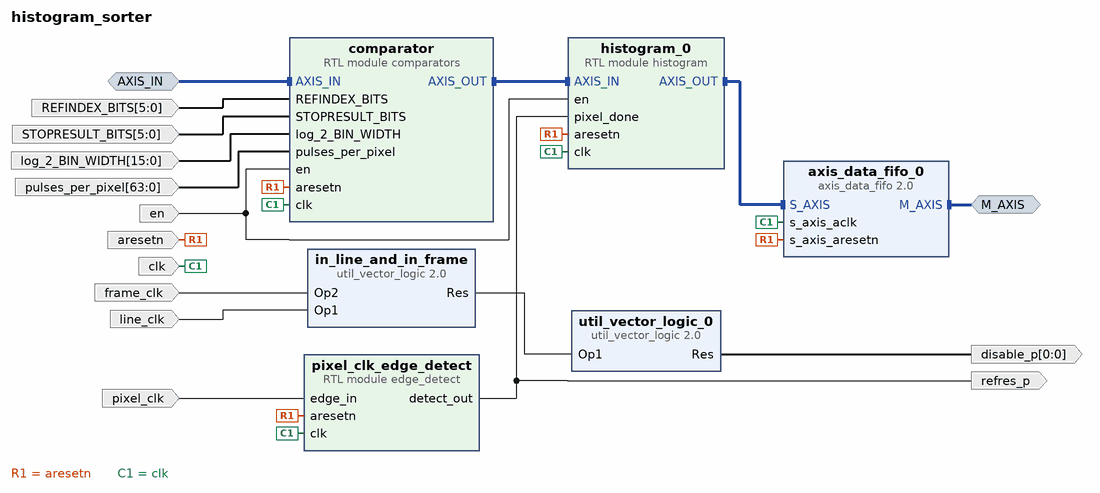
[diagram p0: block diagram of the top level]
# Vivado block design histogram_sorter, xc7z020clg484-1, Vivado 2024.2
create_bd_design histogram_sorter

create_bd_intf_port -mode Slave -vlnv xilinx.com:interface:axis_rtl:1.0 AXIS_IN
set_property -dict [list \
  CONFIG.HAS_TKEEP 0 \
  CONFIG.HAS_TLAST 1 \
  CONFIG.HAS_TREADY 1 \
  CONFIG.HAS_TSTRB 0 \
  CONFIG.LAYERED_METADATA undef \
  CONFIG.TDATA_NUM_BYTES 8 \
  CONFIG.TDEST_WIDTH 0 \
  CONFIG.TID_WIDTH 0 \
  CONFIG.TUSER_WIDTH 0 \
] [get_bd_intf_ports AXIS_IN]
create_bd_intf_port -mode Master -vlnv xilinx.com:interface:axis_rtl:1.0 M_AXIS
create_bd_port -dir I -from 5 -to 0 REFINDEX_BITS
create_bd_port -dir I -from 5 -to 0 STOPRESULT_BITS
create_bd_port -dir I -type rst aresetn
create_bd_port -dir I -type clk clk
set_property -dict {CONFIG.ASSOCIATED_BUSIF AXIS_IN:M_AXIS CONFIG.ASSOCIATED_RESET aresetn} [get_bd_ports clk]
create_bd_port -dir O -from 0 -to 0 disable_p
create_bd_port -dir I en
create_bd_port -dir I frame_clk
create_bd_port -dir I line_clk
create_bd_port -dir I -from 15 -to 0 log_2_BIN_WIDTH
create_bd_port -dir I pixel_clk
create_bd_port -dir I -from 63 -to 0 pulses_per_pixel
create_bd_port -dir O refres_p

create_bd_cell -type ip -vlnv xilinx.com:ip:axis_data_fifo:2.0 axis_data_fifo_0
set_property -dict {CONFIG.FIFO_MEMORY_TYPE auto} [get_bd_cells axis_data_fifo_0]
create_bd_cell -type module -reference comparators comparator
create_bd_cell -type module -reference histogram histogram_0
set_property -dict {CONFIG.NUM_BINS 512} [get_bd_cells histogram_0]
create_bd_cell -type ip -vlnv xilinx.com:ip:util_vector_logic:2.0 in_line_and_in_frame
set_property -dict {CONFIG.C_SIZE 1} [get_bd_cells in_line_and_in_frame]
create_bd_cell -type module -reference edge_detect pixel_clk_edge_detect
create_bd_cell -type ip -vlnv xilinx.com:ip:util_vector_logic:2.0 util_vector_logic_0
set_property -dict {CONFIG.C_OPERATION not CONFIG.C_SIZE 1} [get_bd_cells util_vector_logic_0]

# ---- connections ----

connect_bd_intf_net [get_bd_intf_ports AXIS_IN] [get_bd_intf_pins comparator/AXIS_IN]
connect_bd_intf_net [get_bd_intf_ports M_AXIS] [get_bd_intf_pins axis_data_fifo_0/M_AXIS]
connect_bd_intf_net [get_bd_intf_pins comparator/AXIS_OUT] [get_bd_intf_pins histogram_0/AXIS_IN]
connect_bd_intf_net [get_bd_intf_pins histogram_0/AXIS_OUT] [get_bd_intf_pins axis_data_fifo_0/S_AXIS]
connect_bd_net -net REFINDEX_BITS_0_1 [get_bd_ports REFINDEX_BITS] [get_bd_pins comparator/REFINDEX_BITS]
connect_bd_net -net STOPRESULT_BITS_0_1 [get_bd_ports STOPRESULT_BITS] [get_bd_pins comparator/STOPRESULT_BITS]
connect_bd_net -net aresetn_0_1 [get_bd_ports aresetn] \
  [get_bd_pins axis_data_fifo_0/s_axis_aresetn] [get_bd_pins histogram_0/aresetn] [get_bd_pins pixel_clk_edge_detect/aresetn] \
  [get_bd_pins comparator/aresetn]
connect_bd_net -net clk_0_1 [get_bd_ports clk] \
  [get_bd_pins axis_data_fifo_0/s_axis_aclk] [get_bd_pins histogram_0/clk] [get_bd_pins pixel_clk_edge_detect/clk] \
  [get_bd_pins comparator/clk]
connect_bd_net -net edge_detect_0_detect_out [get_bd_pins pixel_clk_edge_detect/detect_out] \
  [get_bd_ports refres_p] [get_bd_pins histogram_0/pixel_done]
connect_bd_net -net en_0_1 [get_bd_ports en] [get_bd_pins histogram_0/en] [get_bd_pins comparator/en]
connect_bd_net [get_bd_ports frame_clk] [get_bd_pins in_line_and_in_frame/Op2]
connect_bd_net [get_bd_pins in_line_and_in_frame/Res] [get_bd_pins util_vector_logic_0/Op1]
connect_bd_net [get_bd_ports line_clk] [get_bd_pins in_line_and_in_frame/Op1]
connect_bd_net -net log_2_BIN_WIDTH_0_1 [get_bd_ports log_2_BIN_WIDTH] [get_bd_pins comparator/log_2_BIN_WIDTH]
connect_bd_net [get_bd_ports pixel_clk] [get_bd_pins pixel_clk_edge_detect/edge_in]
connect_bd_net -net pulses_per_pixel_0_1 [get_bd_ports pulses_per_pixel] [get_bd_pins comparator/pulses_per_pixel]
connect_bd_net [get_bd_pins util_vector_logic_0/Res] [get_bd_ports disable_p]

validate_bd_design
save_bd_design
